# Altium project LM-003.PrjPcb (part 3 of 4)

## Sheet Connectors.SchDoc: Connectors
size OrCAD A; DocumentNumber: LM-003; Revision: 3.0; SheetNumber: 5; SheetTotal: 11
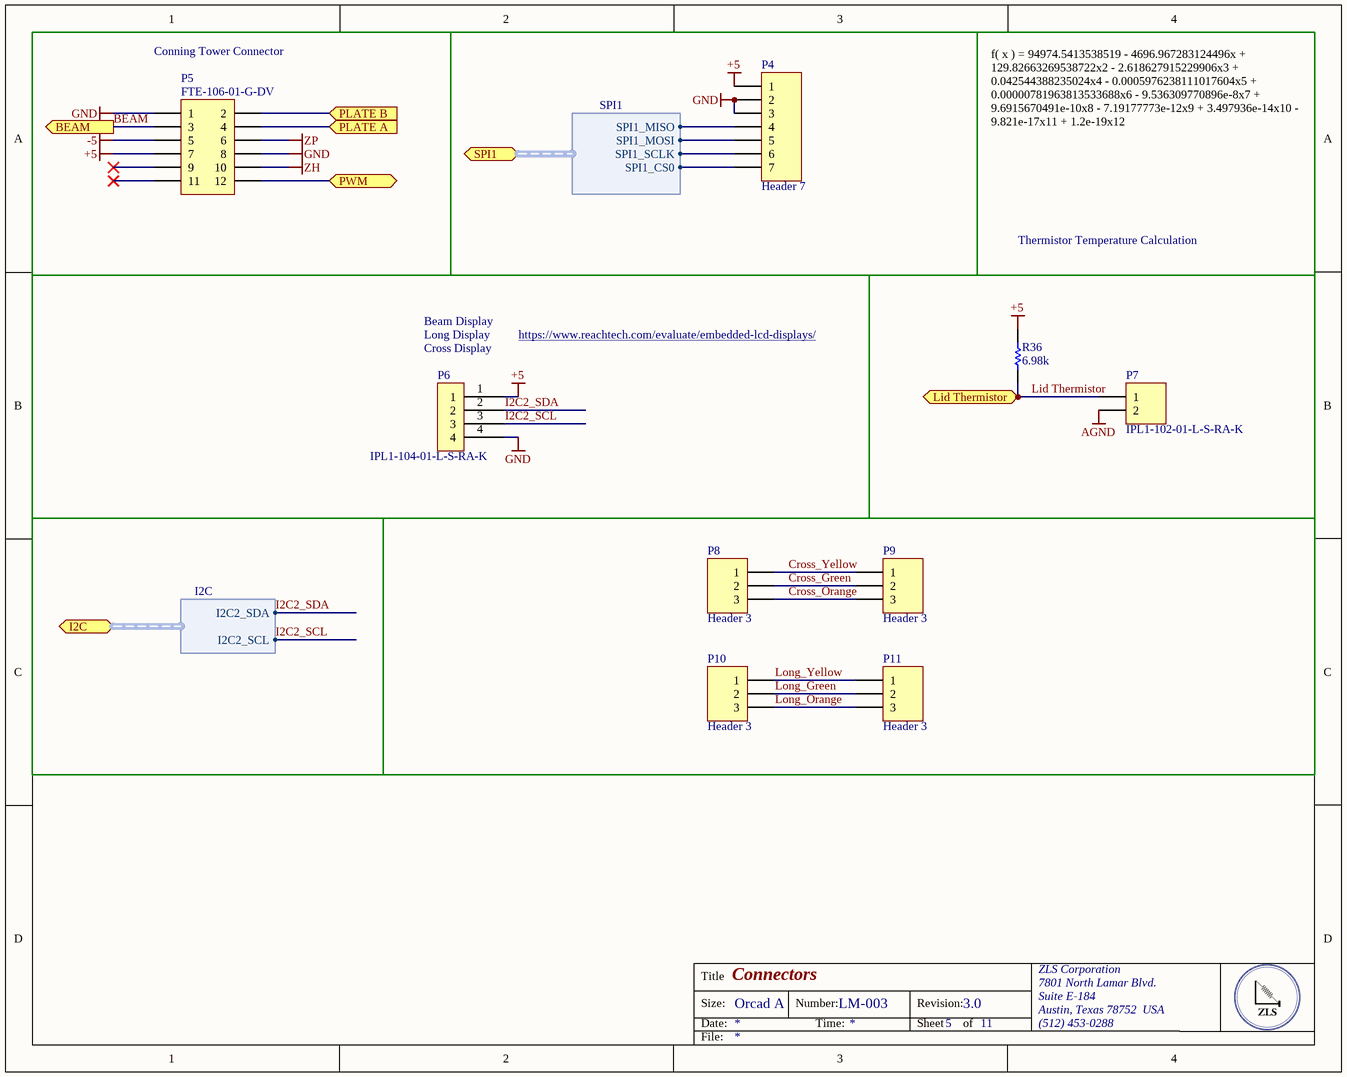
[diagram p4: Connectors.SchDoc]

### Parts
P4  Header 7  [HDR1X7]
P5  FTE-106-01-G-DV  [FTSH-106-01]
P6  IPL1-104-01-L-S-RA-K  [IPL1-104-01]
P7  IPL1-102-01-L-S-RA-K  [IPL1-102-01]
P8  Header 3  [HDR1X3]
P9  Header 3  [HDR1X3]
P10  Header 3  [HDR1X3]
P11  Header 3  [HDR1X3]
R36  Resistance (Ohms): 6.98k  [RESC0805(2012)_N]  (hidden comment: 6K98 1% 0805(2012))

### Blocks framed on the sheet
Conning Tower Connector: P5

### Ports
BEAM (out), I2C (harness I2C), Lid Thermistor, PLATE A (in), PLATE B (in), PWM, SPI1 (harness SPI1)

### Harnesses
I2C: I2C2_SDA, I2C2_SCL
SPI1: SPI1_CS0, SPI1_MISO, SPI1_MOSI, SPI1_SCLK

### Nets
+5: P4.1 P5.7 P6.1 R36.2
-5: P5.5
AGND: P7.2
GND: P4.2 P4.3 P5.1 P5.8 P6.4
ZH: P5.10
ZP: P5.6
BEAM: P5.3 ; port BEAM
Cross_Green: P8.2 P9.2
Cross_Orange: P8.3 P9.3
Cross_Yellow: P8.1 P9.1
I2C2_SCL: P6.3 ; port I2C.I2C2_SCL
I2C2_SDA: P6.2 ; port I2C.I2C2_SDA
Lid Thermistor: P7.1 R36.1 ; port Lid Thermistor
Long_Green: P10.2 P11.2
Long_Orange: P10.3 P11.3
Long_Yellow: P10.1 P11.1
SPI1_CS0: P4.7 ; port SPI1.SPI1_CS0
SPI1_MISO: P4.4 ; port SPI1.SPI1_MISO
SPI1_MOSI: P4.5 ; port SPI1.SPI1_MOSI
SPI1_SCLK: P4.6 ; port SPI1.SPI1_SCLK
NetP5_2: P5.2 ; port PLATE B
NetP5_4: P5.4 ; port PLATE A
NetP5_12: P5.12 ; port PWM

Not connected (* = marked no-connect by the designer): P5 9* 11*

### Notes on the sheet
- f( x ) = 94974.5413538519 - 4696.967283124496x + 129.82663269538722x2 - 2.618627915229906x3 + 0.042544388235024x4 - 0.0005976238111017604x5 + 0.00000781963813533688x6 - 9.536309770896e-8x7 + 9.6915670491e-10x8 - 7.19177773e-12x9 + 3.497936e-14x10 - 9.821e-17x11 + 1.2e-19x12
- Thermistor Temperature Calculation
- (near P6) Cross Display
- Long Display
- Beam Display
- https://www.reachtech.com/evaluate/embedded-lcd-displays/
- Title
- Size:
- Date:
- Orcad A
- Number:
- Time:
- Revision:
- Sheet
- of
- ZLS Corporation
- 7801 North Lamar Blvd.
- Suite E-184
- Austin, Texas 78752  USA
- (512) 453-0288
- File:

### Library data of the parts
P4 = Header 7: Header, 7-Pin; LatestRevisionDate: 17-Jul-2002; LatestRevisionNote: Re-released for DXP Platform.; Publisher: Altium Limited
P5 = Header 6X2: Header, 6-Pin, Dual row; Manufacturer: Samtec; Connector Type: Male Header; No. of positions: 6; No. of Rows: 2; Pitch: 0.8mm; Number of Positions: 12; Number of Positions Loaded: All; Row Spacing: 0.047" (1.20mm); Molding Height Above Board: 0.067" (1.70mm); Pitch Spacing: 0.8; Contact Termination: Surface Mount Vertical; LatestRevisionDate: 17-Jul-2002; LatestRevisionNote: Re-released for DXP Platform.; Publisher: Altium Limited; Supplier 1: Newark; ComponentLink1URL: http://www.samtec.com/; ComponentLink2URL: http://www.samtec.com/technical-specifications/Default.aspx?SeriesMaster=FTE; Mounting Technology: Surface Mount; Supplier 2: Digi-Key; Manufacturer Part Number: FTE-106-01-G-DV; RoHS: RoHS Compliant; Category: Connectors, Interconnects; Stock 2: 0; Pricing 2: 1=7.49, 10=6.49, 100=5.4911, 500=4.36794, 1000=3.55676, 5000=3.24476, 10000=3.11996 (USD); Packaging: Tube; Number of Rows: 2; Height Stacking (Mating): -; Contact Mating Length: 0.075" (1.90mm); Mounting Type: Surface Mount; Termination: Solder; Contact Finish: Gold; Contact Finish Thickness: 10µin (0.25µm); Features: -; Color: Black; ComponentLink3URL: http://www.samtec.com/documents/webfiles/pdf/FTE_SM.PDF; ComponentLink3Description: http://www.samtec.com/documents/webfiles/pdf/FTE_SM.PDF; Stock 1: 0; Pricing 1: 1=3.26, 10=2.85, 100=2.43, 500=2, 1000=1.72, 5000=1.55, 10000=1.48 (USD); Series: FTE; No. of Contacts: 12; Gender: Header; Contact Plating: Gold; Contact Material: Phosphor Bronze; ComponentLink4URL: http://www.samtec.com/ftppub/pdf/FTE_SM.PDF; ComponentLink4Description: http://www.samtec.com/ftppub/pdf/FTE_SM.PDF; Supplier Part Number 1: 11P4479; Supplier Part Number 2: SAM1144-06-ND
P6 = 53047-0410: .100 TERMINAL ASSY; Manufacturer 1: Samtec Inc.; Category 1: Connectors, Interconnects; Connector Type: Header; Pitch - Mating: 0.100" (2.54mm); Style: Board to Cable/Wire; Shrouding: Shrouded - 4 Wall; Number of Positions: 4; Number of Positions Loaded: All; Contact Length - Mating: 0.215" (5.46mm); Contact Length - Post: 0.085" (2.16mm); Material Flammability Rating: UL94 V-0; Voltage Rating: 675VAC, 954VDC; Supplier 1: Digi-Key; Supplier Part Number 1: SAM9597-ND; Manufacturer Part Number 1: IPL1-104-01-L-S-RA-K; RoHS 1: RoHS Compliant; Description 1: .100 TERMINAL ASSY; Stock 1: 100; Pricing 1: 1=2.53, 10=2.424, 25=2.222, 50=2.121, 100=2.02, 250=1.76752, 500=1.717, 1000=1.4645, 2500=1.3635 (USD); Packaging: Tube; Part Status: Active; Contact Type: Male Pin; Number of Rows: 1; Row Spacing - Mating: -; Mounting Type: Through Hole, Right Angle; Termination: Solder; Fastening Type: Locking Ramp; Overall Contact Length: -; Insulation Height: 0.240" (6.10mm); Contact Shape: Square; Contact Finish - Mating: Gold; Contact Finish Thickness - Mating: 10µin (0.25µm); Contact Finish - Post: Tin; Contact Material: Phosphor Bronze; Insulation Material: Liquid Crystal Polymer (LCP); Features: -; Operating Temperature: -55°C ~ 125°C; Ingress Protection: -; Insulation Color: Natural; Current Rating: -; Mated Stacking Heights: -; Contact Finish Thickness - Post: -; Applications: -; ComponentLink1URL: http://suddendocs.samtec.com/prints/ipl1-1xx-xx-xxx-s-xx-x-xx-mkt.pdf; ComponentLink1Description: http://suddendocs.samtec.com/prints/ipl1-1xx-xx-xxx-s-xx-x-xx-mkt.pdf
P7 = Header 2H: CONN SHROUDED PWR HEADER 2POS; Manufacturer 1: Samtec Inc.; Category 1: Connectors, Interconnects; Pitch - Mating: 0.100" (2.54mm); Style: Board to Cable/Wire; Shrouding: Shrouded - 4 Wall; Number of Positions: 2; Number of Positions Loaded: All; Contact Length - Mating: 0.215" (5.46mm); Contact Length - Post: 0.085" (2.16mm); Material Flammability Rating: UL94 V-0; Voltage Rating: 675VAC, 954VDC; Supplier 1: Digi-Key; Supplier Part Number 1: SAM10566-ND; Manufacturer Part Number 1: IPL1-102-01-L-S-RA-K; RoHS 1: RoHS Compliant; Description 1: CONN SHROUDED PWR HEADER 2POS; Stock 1: 0; Pricing 1: 1=2.44, 10=2.217, 25=2.0816, 50=1.991, 100=1.9005, 250=1.71952, 500=1.58376, 1000=1.3575, 2500=1.267 (USD); Packaging: Tube; Part Status: Active; Connector Type: Header; Contact Type: Male Pin; Number of Rows: 1; Row Spacing - Mating: -; Mounting Type: Through Hole, Right Angle; Termination: Solder; Fastening Type: Locking Ramp; Overall Contact Length: -; Insulation Height: 0.240" (6.10mm); Contact Shape: Square; Contact Finish - Mating: Gold; Contact Finish Thickness - Mating: 10µin (0.25µm); Contact Finish - Post: Tin; Contact Material: Phosphor Bronze; Insulation Material: Liquid Crystal Polymer (LCP); Features: -; Operating Temperature: -55°C ~ 125°C; Ingress Protection: -; Insulation Color: Natural; Current Rating: -; Mated Stacking Heights: -; Contact Finish Thickness - Post: -; Applications: -; ComponentLink1URL: http://suddendocs.samtec.com/prints/ipl1-1xx-xx-xxx-s-xx-x-xx-mkt.pdf; ComponentLink1Description: http://suddendocs.samtec.com/prints/ipl1-1xx-xx-xxx-s-xx-x-xx-mkt.pdf
P8-P11 = Header 3: Header, 3-Pin; LatestRevisionDate: 17-Jul-2002; LatestRevisionNote: Re-released for DXP Platform.; Publisher: Altium Limited
R36 = CMP-1013-00606-1: 6K98 0.125W 1% 0805 (2012 Metric)  SMD; Manufacturer: Vishay Dale; Manufacturer Part Number: CRCW08056K98FKEA; Power (Watts): 0.125W, 1/8W; Temperature Coefficient: ±100ppm/°C; Supplier 1: Digi-Key; Supplier Part Number 1: 541-6.98KCCT-ND; RoHS: RoHS Compliant; Category: Resistors; Stock 1: 34245; Pricing 1: 1=0.1, 10=0.044, 100=0.0178, 1000=0.00802, 2500=0.00696 (USD); Packaging: Cut Tape (CT); Part Status: Active; Tolerance: ±1%; Composition: Thick Film; Features: Automotive AEC-Q200; Operating Temperature: -55°C ~ 155°C; Package / Case: 0805 (2012 Metric); Supplier Device Package: 0805; Size / Dimension: 0.079" L x 0.049" W (2.00mm x 1.25mm); Height - Seated (Max): 0.020" (0.50mm); Failure Rate: -; ComponentLink1URL: http://www.vishay.com/docs/20035/dcrcwe3.pdf; ComponentLink1Description: http://www.vishay.com/docs/20035/dcrcwe3.pdf

## Sheet heater_control.SchDoc: Heater Control
size Tabloid; DocumentNumber: LM-003; Revision: 3.0; SheetNumber: 6; SheetTotal: 11
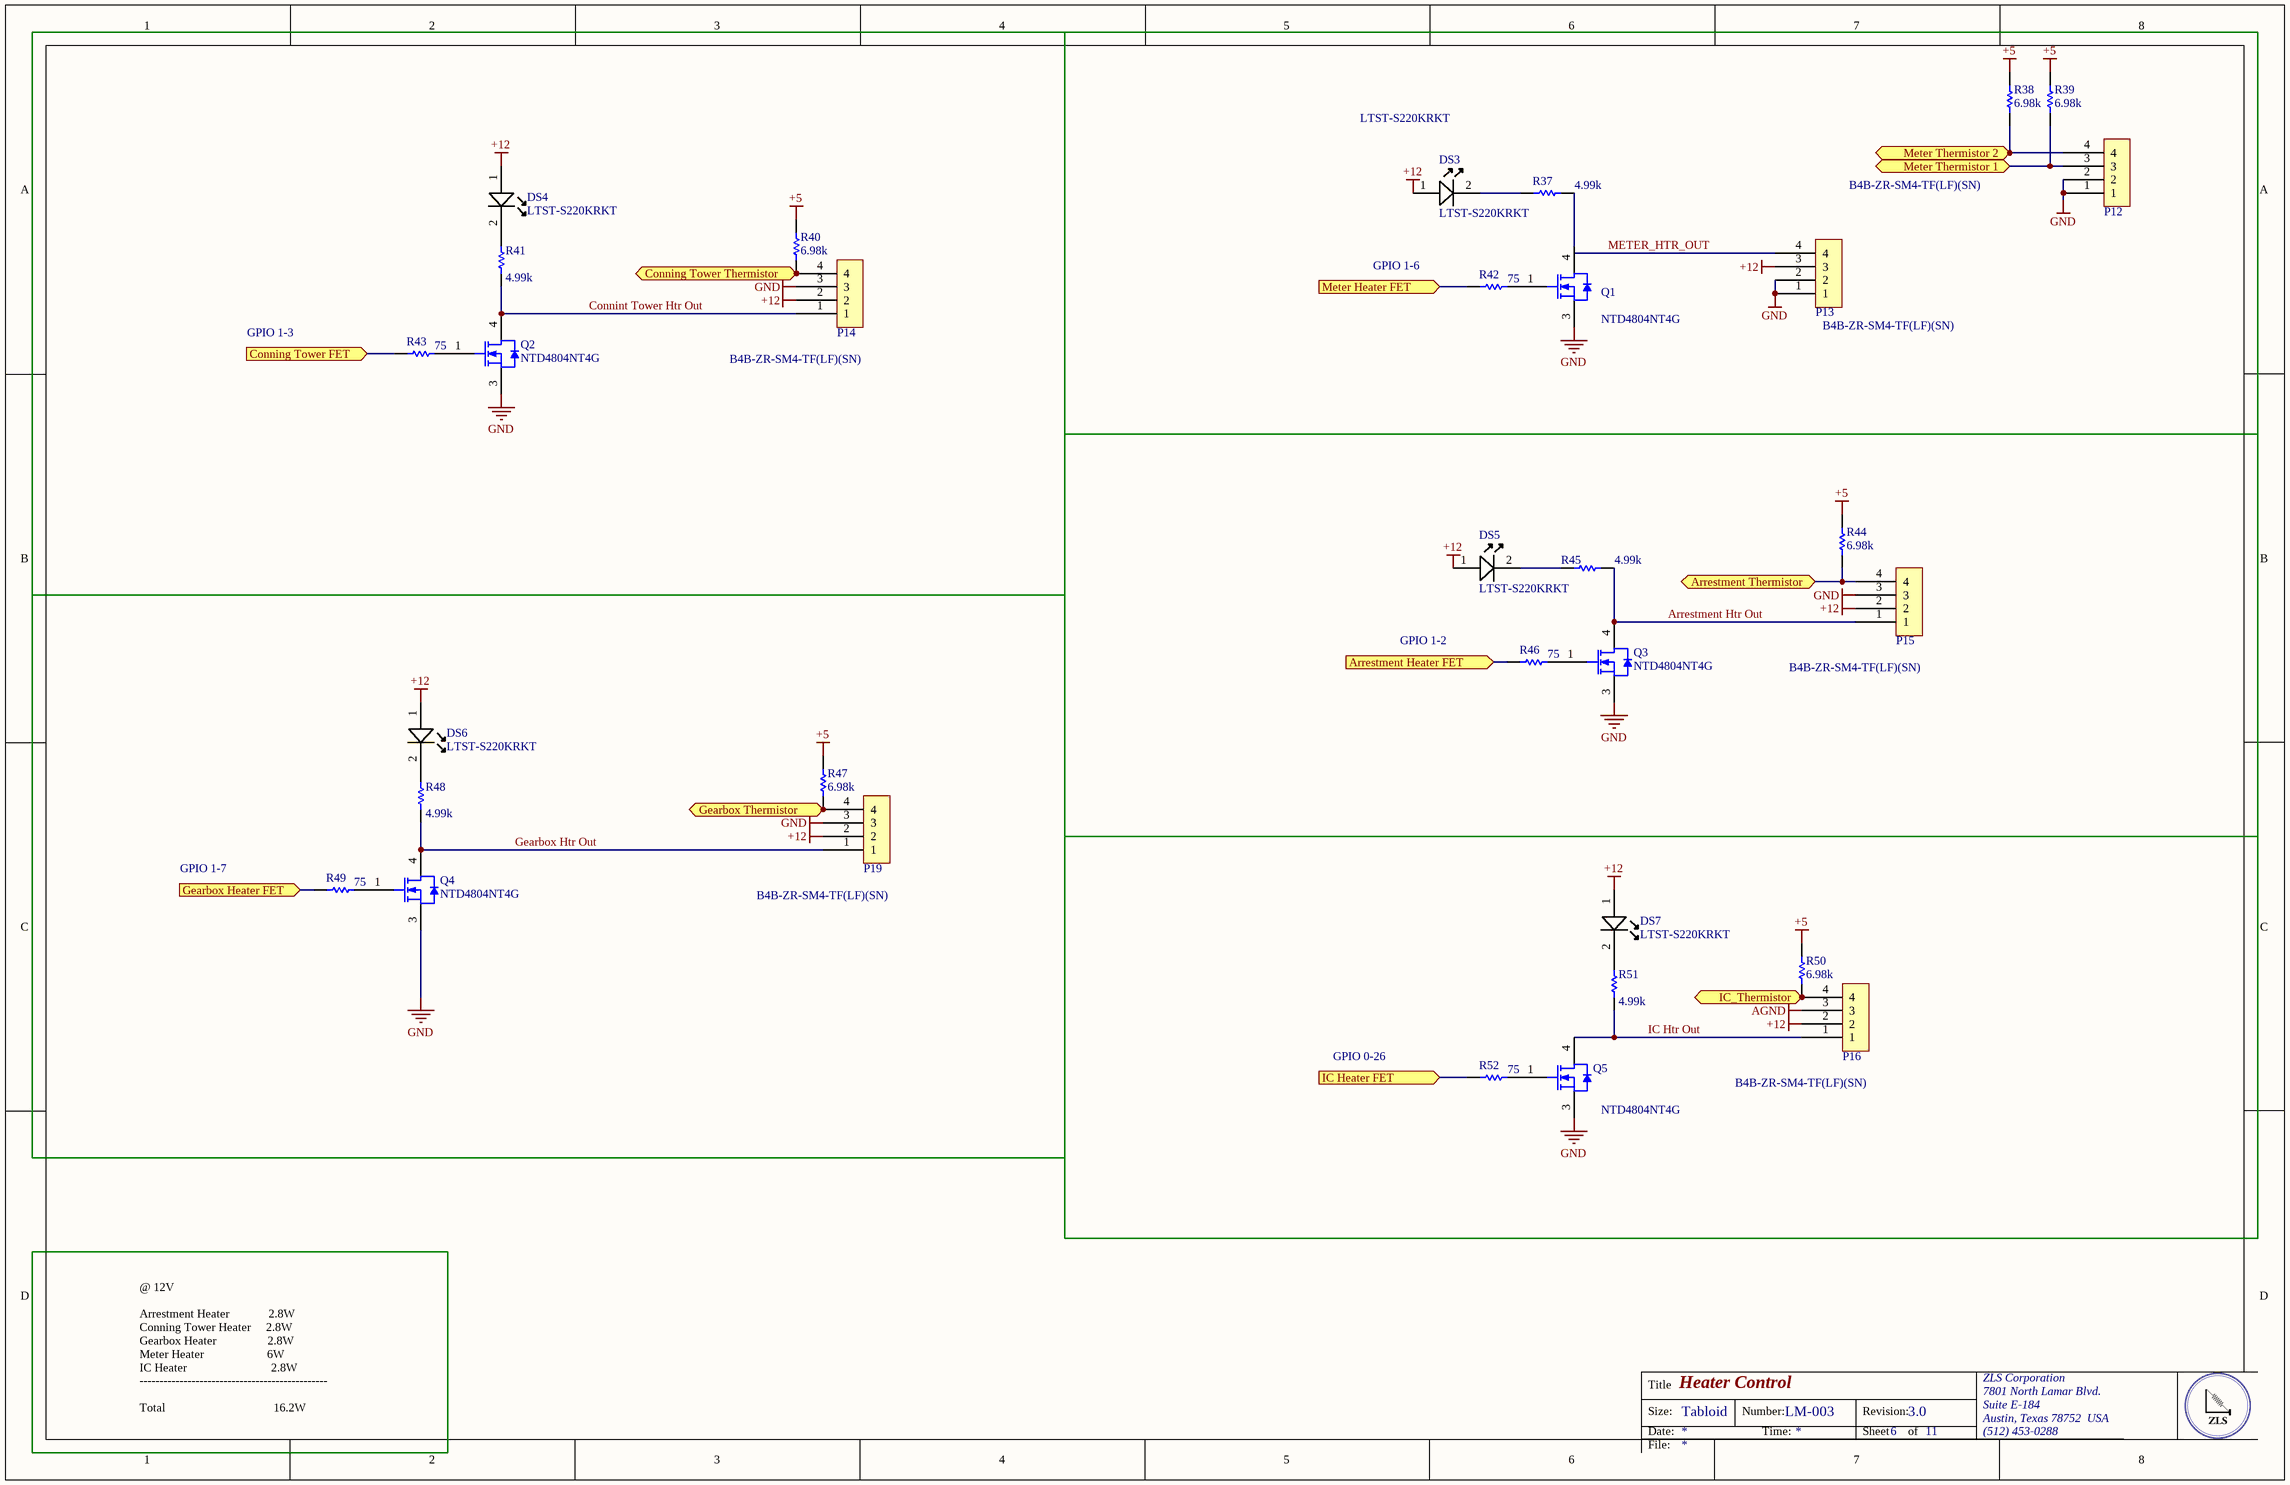
[diagram p5: heater_control.SchDoc]

### Parts
DS3  Manufacturer Part Number: LTST-S220KRKT  [0805C_L]  (hidden comment: Visible Name Value Type    False Description Lite-On LTST-S220KRKT Red LED, 631 nm 2012 (0805) Side View, Rectangle Lens SMD package STRING)
DS4  Manufacturer Part Number: LTST-S220KRKT  [0805C_L]  (hidden comment: Visible Name Value Type    False Description Lite-On LTST-S220KRKT Red LED, 631 nm 2012 (0805) Side View, Rectangle Lens SMD package STRING)
DS5  Manufacturer Part Number: LTST-S220KRKT  [0805C_L]  (hidden comment: Visible Name Value Type    False Description Lite-On LTST-S220KRKT Red LED, 631 nm 2012 (0805) Side View, Rectangle Lens SMD package STRING)
DS6  Manufacturer Part Number: LTST-S220KRKT  [0805C_L]  (hidden comment: Visible Name Value Type    False Description Lite-On LTST-S220KRKT Red LED, 631 nm 2012 (0805) Side View, Rectangle Lens SMD package STRING)
DS7  Manufacturer Part Number: LTST-S220KRKT  [0805C_L]  (hidden comment: Visible Name Value Type    False Description Lite-On LTST-S220KRKT Red LED, 631 nm 2012 (0805) Side View, Rectangle Lens SMD package STRING)
P12  Manufacturer Part Number: B4B-ZR-SM4-TF(LF)(SN)  [B4B-ZR-SM4-TF]  (hidden comment: CONN HEADER ZH TOP 4POS 1.5MM)
P13  Manufacturer Part Number: B4B-ZR-SM4-TF(LF)(SN)  [B4B-ZR-SM4-TF]  (hidden comment: CONN HEADER ZH TOP 4POS 1.5MM)
P14  Manufacturer Part Number: B4B-ZR-SM4-TF(LF)(SN)  [B4B-ZR-SM4-TF]  (hidden comment: CONN HEADER ZH TOP 4POS 1.5MM)
P15  Manufacturer Part Number: B4B-ZR-SM4-TF(LF)(SN)  [B4B-ZR-SM4-TF]  (hidden comment: CONN HEADER ZH TOP 4POS 1.5MM)
P16  Manufacturer Part Number: B4B-ZR-SM4-TF(LF)(SN)  [B4B-ZR-SM4-TF]  (hidden comment: CONN HEADER ZH TOP 4POS 1.5MM)
P19  Manufacturer Part Number: B4B-ZR-SM4-TF(LF)(SN)  [B4B-ZR-SM4-TF]  (hidden comment: CONN HEADER ZH TOP 4POS 1.5MM)
Q1  NTD4804NT4G  [ONSC-DPAK-3-369AA-01_V]
Q2  NTD4804NT4G  [ONSC-DPAK-3-369AA-01_V]
Q3  NTD4804NT4G  [ONSC-DPAK-3-369AA-01_V]
Q4  NTD4804NT4G  [ONSC-DPAK-3-369AA-01_V]
Q5  NTD4804NT4G  [ONSC-DPAK-3-369AA-01_V]
R37  Resistance (Ohms): 4.99k  [RESC0805(2012)_L]
R38  Resistance (Ohms): 6.98k  [RESC0805(2012)_N]  (hidden comment: 6K98 1% 0805(2012))
R39  Resistance (Ohms): 6.98k  [RESC0805(2012)_N]  (hidden comment: 6K98 1% 0805(2012))
R40  Resistance (Ohms): 6.98k  [RESC0805(2012)_N]  (hidden comment: 6K98 1% 0805(2012))
R41  Resistance (Ohms): 4.99k  [RESC0805(2012)_L]
R42  Resistance (Ohms): 75  [RESC0805(2012)_L]
R43  Resistance (Ohms): 75  [RESC0805(2012)_L]
R44  Resistance (Ohms): 6.98k  [RESC0805(2012)_N]  (hidden comment: 6K98 1% 0805(2012))
R45  Resistance (Ohms): 4.99k  [RESC0805(2012)_L]
R46  Resistance (Ohms): 75  [RESC0805(2012)_L]
R47  Resistance (Ohms): 6.98k  [RESC0805(2012)_N]  (hidden comment: 6K98 1% 0805(2012))
R48  Resistance (Ohms): 4.99k  [RESC0805(2012)_L]
R49  Resistance (Ohms): 75  [RESC0805(2012)_L]
R50  Resistance (Ohms): 6.98k  [RESC0805(2012)_N]  (hidden comment: 6K98 1% 0805(2012))
R51  Resistance (Ohms): 4.99k  [RESC0805(2012)_L]
R52  Resistance (Ohms): 75  [RESC0805(2012)_L]

### Blocks framed on the sheet
GPIO 1-3: DS4 P14 Q2 R40 R41 R43
GPIO 1-2: DS5 P15 Q3 R44-R46
GPIO 1-7: DS6 P19 Q4 R47-R49
GPIO 0-26: DS7 P16 Q5 R50-R52

### Ports
Arrestment Heater FET (in), Arrestment Thermistor, Conning Tower FET (in), Conning Tower Thermistor (out), Gearbox Heater FET (in), Gearbox Thermistor (out), IC Heater FET (in), IC_Thermistor, Meter Heater FET (in), Meter Thermistor 1, Meter Thermistor 2

### Nets
+5: R38.1 R39.2 R40.2 R44.1 R47.2 R50.1
+12: DS3.1(A) DS4.1(A) DS5.1(A) DS6.1(A) DS7.1(A) P13.3 P14.2 P15.2 P16.2 P19.2
AGND: P16.3
GND: P12.1 P12.2 P13.1 P13.2 P14.3 P15.3 P19.3 Q1.3(S) Q2.3(S) Q3.3(S) Q4.3(S) Q5.3(S)
Arrestment Htr Out: P15.1 Q3.4(D) R45.2
Connint Tower Htr Out: P14.1 Q2.4(D) R41.1
Gearbox Htr Out: P19.1 Q4.4(D) R48.1
IC Htr Out: P16.1 Q5.4(D) R51.2
METER_HTR_OUT: P13.4
NetDS3_2: DS3.2(K) R37.1
NetDS4_2: DS4.2(K) R41.2
NetDS5_2: DS5.2(K) R45.1
NetDS6_2: DS6.2(K) R48.2
NetDS7_2: DS7.2(K) R51.1
NetP12_3: P12.3 R39.1 ; port Meter Thermistor 1
NetP12_4: P12.4 R38.2 ; port Meter Thermistor 2
NetP14_4: P14.4 R40.1 ; port Conning Tower Thermistor
NetP15_4: P15.4 R44.2 ; port Arrestment Thermistor
NetP16_4: P16.4 R50.2 ; port IC_Thermistor
NetP19_4: P19.4 R47.1 ; port Gearbox Thermistor
NetQ1_1: Q1.1(G) R42.2
NetQ1_4: Q1.4(D) R37.2
NetQ2_1: Q2.1(G) R43.2
NetQ3_1: Q3.1(G) R46.2
NetQ4_1: Q4.1(G) R49.2
NetQ5_1: Q5.1(G) R52.2
NetR42_1: R42.1 ; port Meter Heater FET
NetR43_1: R43.1 ; port Conning Tower FET
NetR46_1: R46.1 ; port Arrestment Heater FET
NetR49_1: R49.1 ; port Gearbox Heater FET
NetR52_1: R52.1 ; port IC Heater FET

Not connected (* = marked no-connect by the designer): P12 5 6; P13 5 6; P14 5 6; P15 5 6; P16 5 6; P19 5 6

### Notes on the sheet
- LTST-S220KRKT
- GPIO 1-6
- @ 12V
  Arrestment Heater             2.8W
  Conning Tower Heater     2.8W
  Gearbox Heater                 2.8W
  Meter Heater                     6W
  IC Heater                            2.8W
  -----------------------------------------------
  Total                                    16.2W
- Title
- Size:
- Date:
- Tabloid
- Number:
- Time:
- Revision:
- Sheet
- of
- ZLS Corporation
- 7801 North Lamar Blvd.
- Suite E-184
- Austin, Texas 78752  USA
- (512) 453-0288
- File:

### Library data of the parts
DS3-DS7 = LED A/K: Manufacturer: Vishay / Lite-On; Lens Colour: Colorless; Lens Style: Diffused,Colorless; Viewing Angle: 130°; Luminous Intensity: 54mcd; Forward Current: 20mA; Forward Voltage: 2V; Power Rating: 75mW; Dominant Wavelength: 631nm; Lens Transparency: Clear; Number of Elements: 1; Wavelength: 639nm; Supplier 1: Digi-Key; Supplier Part Number 1: 160-1469-1-ND; Stock 1: 108191; Pricing 1: 1=0.31, 10=0.225, 25=0.1656, 100=0.1183, 250=0.0804, 500=0.071, 1000=0.0556 (USD); Mount: Surface Mount; Case/Package: 0805; Number of Pins: 2; Colour: Red; Case Code (Metric): 2012; Case Code (Imperial): 0805; Min Operating Temperature: -55°C; Max Operating Temperature: 85°C; Packaging: Tape and Reel; Package Quantity: 4000; Illumination Colour: Red; Test Current: 20mA; Power Dissipation: 75mW; Number of LEDs: 1; Length: 2.1mm; Height: 0.6mm; Width: 1mm; Depth: 0.6mm; Radiation Hardening: No; Lead Free: Lead Free; ComponentLink1URL: https://datasheet.ciiva.com/2110/s-110-ltst-s220krkt-2110132.pdf; ComponentLink1Description: https://datasheet.ciiva.com/2110/s-110-ltst-s220krkt-2110132.pdf; ComponentLink2URL: https://datasheet.ciiva.com/2110/s-110-ltst-s220krkt-2110133.pdf; ComponentLink2Description: https://datasheet.ciiva.com/2110/s-110-ltst-s220krkt-2110133.pdf; ComponentLink3URL: https://datasheet.ciiva.com/2110/s-110-ltst-s220krkt-2110134.pdf; ComponentLink3Description: https://datasheet.ciiva.com/2110/s-110-ltst-s220krkt-2110134.pdf; ComponentLink4URL: https://datasheet.ciiva.com/12403/lite-on-ltst-s220krkt-187389-12403798.pdf; ComponentLink4Description: https://datasheet.ciiva.com/12403/lite-on-ltst-s220krkt-187389-12403798.pdf; ComponentLink5URL: https://datasheet.ciiva.com/16345/lite-onltst-s220krkt-16345511.pdf; ComponentLink5Description: https://datasheet.ciiva.com/16345/lite-onltst-s220krkt-16345511.pdf; ComponentLink6URL: https://datasheet.ciiva.com/15118/getdatasheetpartid-225752-15118120.pdf; ComponentLink6Description: https://datasheet.ciiva.com/15118/getdatasheetpartid-225752-15118120.pdf; ComponentLink7URL: https://datasheet.ciiva.com/14633/0900766b80dc0b76-14633737.pdf; ComponentLink7Description: https://datasheet.ciiva.com/14633/0900766b80dc0b76-14633737.pdf; ComponentLink8URL: https://datasheet.ciiva.com/11775/0900766b80dc0b76-11775439.pdf; ComponentLink8Description: https://datasheet.ciiva.com/11775/0900766b80dc0b76-11775439.pdf
P12-P16 P19 = B4B-ZR-SM4-TF: Manufacturer: JST Sales America Inc.; Pitch - Mating: 0.059" (1.50mm); Style: Board to Cable/Wire; Shrouding: Shrouded - 4 Wall; Number of Positions: 4; Number of Positions Loaded: All; Material Flammability Rating: UL94 V-0; Current Rating: 1A; Voltage Rating: 50V; Mated Stacking Heights: 6.4mm; Supplier 1: Digi-Key; Supplier Part Number 1: 455-1683-1-ND; RoHS: RoHS Compliant; Category: Connectors, Interconnects; Stock 1: 38430; Pricing 1: 1=0.71, 10=0.67, 100=0.5138, 500=0.44682 (USD); Packaging: Cut Tape (CT); Part Status: Active; Connector Type: Header; Contact Type: Male Pin; Number of Rows: 1; Row Spacing - Mating: -; Mounting Type: Surface Mount; Termination: Solder; Fastening Type: Detent Lock; Contact Length - Mating: -; Contact Length - Post: -; Overall Contact Length: -; Insulation Height: 0.197" (5.00mm); Contact Shape: Circular; Contact Finish - Mating: Tin; Contact Finish Thickness - Mating: -; Contact Finish - Post: Tin; Contact Material: Brass; Insulation Material: Polyamide (PA6T), Nylon 6T, Glass Filled; Features: Solder Retention; Operating Temperature: -25°C ~ 85°C; Ingress Protection: -; Insulation Color: Natural; Contact Finish Thickness - Post: -; Applications: -; ComponentLink1URL: http://www.jst-mfg.com/product/pdf/eng/eZH.pdf; ComponentLink1Description: http://www.jst-mfg.com/product/pdf/eng/eZH.pdf
Q1-Q5 = CMP-1058-00341-1: Power MOSFET, 30 V, 117 A, Single N-Channel, 3-Pin DPAK, Pb-Free, Tape and Reel; Manufacturer: On Semiconductor; Coss Typ (pF): 952; Qrr Typ (nC): 30; VGS Max (V): 20; ID Max (A): 117; Crss Typ (pF): 556; Channel Polarity: N Channel; Ciss Typ (pF): 4490; VGS(th) Max (V): 2.5; ComponentLink2Description: Datasheet; ComponentLink3Description: Package Specification; Mounting Technology: Surface Mount; PackageDescription: 3-Pin Flange Mount, Body 6.54 x 6.095 mm, Pitch 2.29 mm; PackageVersion: Rev. B, 06/2010; PartNumber: NTD4804NT4G; ComponentLink2URL: http://www.onsemi.cn/pub_link/Collateral/NTD4804N-D.PDF; RoHS: Pb-Free; Configuration: Single; DatasheetVersion: Rev. 8; PackageReference: DPAK-3-369AA-01; ComponentLink3URL: http://www.onsemi.cn/pub_link/Collateral/369AA.PDF; ComponentLink1Description: Manufacturer URL; Packing: Tape and Reel; Package Type: DPAK-3; ComponentLink1URL: http://www.onsemi.com/; V(BR)DSS Min (V): 30; Supplier 1: Digi-Key; Supplier Part Number 1: NTD4804NT4GOSDKR-ND
R37 R41 R45 R48 R51 = CMP-1013-00393-1: Manufacturer: Vishay Dale; Manufacturer Part Number: CRCW08054K99FKEA; Tolerance: ±1%; Power (Watts): 0.125W, 1/8W; Temperature Coefficient: ±100ppm/°C; Supplier 1: Digi-Key; Supplier Part Number 1: 541-4.99KCCT-ND; RoHS: RoHS Compliant; Category: Resistors; Stock 1: 93740; Pricing 1: 1=0.1, 10=0.044, 100=0.0178, 1000=0.00802, 2500=0.00696 (USD); Packaging: Cut Tape (CT); Part Status: Active; Composition: Thick Film; Features: Automotive AEC-Q200; Operating Temperature: -55°C ~ 155°C; Package / Case: 0805 (2012 Metric); Supplier Device Package: 0805; Size / Dimension: 0.079" L x 0.049" W (2.00mm x 1.25mm); Height - Seated (Max): 0.020" (0.50mm); Failure Rate: -; ComponentLink1URL: http://www.vishay.com/docs/20035/dcrcwe3.pdf; ComponentLink1Description: http://www.vishay.com/docs/20035/dcrcwe3.pdf
R38-R40 R44 R47 R50 = CMP-1013-00606-1: as R36 on sheet Connectors; Supplier 1: Digi-Key; Supplier Part Number 1: 541-6.98KCCT-ND; RoHS: RoHS Compliant; Category: Resistors; Stock 1: 34245; Pricing 1: 1=0.1, 10=0.044, 100=0.0178, 1000=0.00802, 2500=0.00696 (USD); Packaging: Cut Tape (CT); Part Status: Active; Tolerance: ±1%; Composition: Thick Film; Features: Automotive AEC-Q200; Operating Temperature: -55°C ~ 155°C; Package / Case: 0805 (2012 Metric); Supplier Device Package: 0805; Size / Dimension: 0.079" L x 0.049" W (2.00mm x 1.25mm); Height - Seated (Max): 0.020" (0.50mm); Failure Rate: -; ComponentLink1URL: http://www.vishay.com/docs/20035/dcrcwe3.pdf; ComponentLink1Description: http://www.vishay.com/docs/20035/dcrcwe3.pdf
R42 R43 R46 R49 R52 = CMP-1013-00393-1: Manufacturer: Vishay Dale; Manufacturer Part Number: CRCW080575R0FKEA; Tolerance: ±1%; Power (Watts): 0.125W, 1/8W; Temperature Coefficient: ±100ppm/°C; Supplier 1: Digi-Key; Supplier Part Number 1: 541-75.0CCT-ND; RoHS: RoHS Compliant; Category: Resistors; Stock 1: 32546; Pricing 1: 1=0.1, 10=0.044, 100=0.0178, 1000=0.00802, 2500=0.00696 (USD); Packaging: Cut Tape (CT); Part Status: Active; Composition: Thick Film; Features: Automotive AEC-Q200; Operating Temperature: -55°C ~ 155°C; Package / Case: 0805 (2012 Metric); Supplier Device Package: 0805; Size / Dimension: 0.079" L x 0.049" W (2.00mm x 1.25mm); Height - Seated (Max): 0.020" (0.50mm); Failure Rate: -; ComponentLink1URL: http://www.vishay.com/docs/20035/dcrcwe3.pdf; ComponentLink1Description: http://www.vishay.com/docs/20035/dcrcwe3.pdf

## Sheet Power Monitor.SchDoc: Power Monitor
size OrCAD A; DocumentNumber: LM-003; Revision: 3.0; SheetNumber: 7; SheetTotal: 11
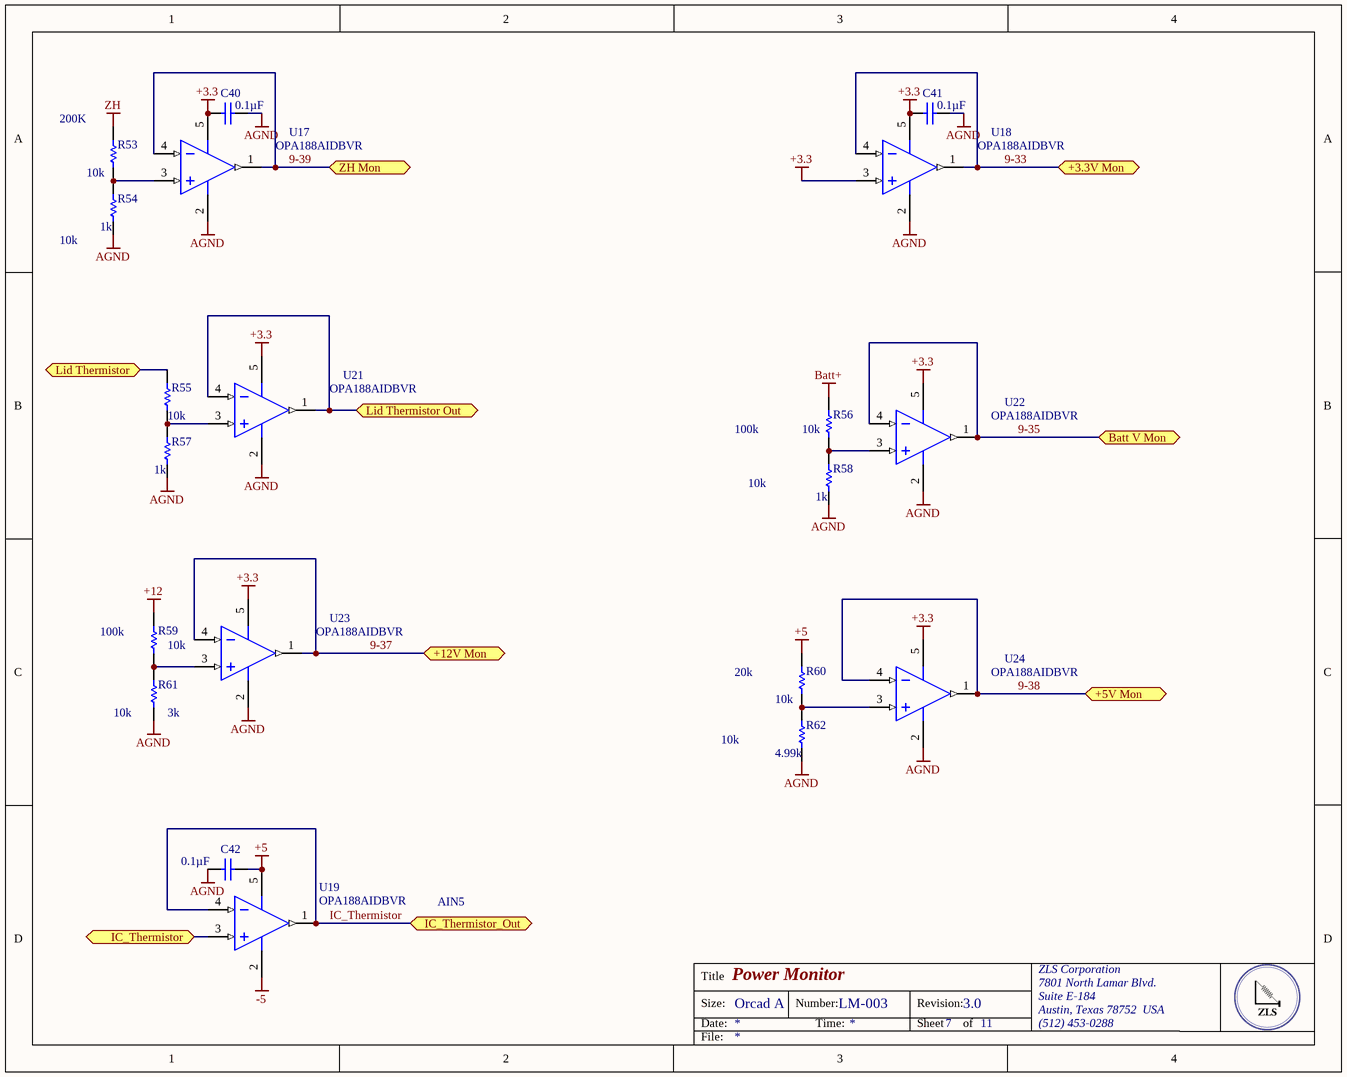
[diagram p6: Power Monitor.SchDoc]

### Parts
(Parts that share a designator on the sheet are numbered #1, #2 ... from top to bottom, then left to right.)
C40  Capacitance: 0.1µF  [CAPC0805(2012)145_N]  (hidden comment: CAP CER 0.1UF 25V X7R 0805)
C41  Capacitance: 0.1µF  [CAPC0805(2012)145_N]  (hidden comment: CAP CER 0.1UF 25V X7R 0805)
C42  Capacitance: 0.1µF  [CAPC0805(2012)145_N]  (hidden comment: CAP CER 0.1UF 16V X7R 0805)
R53  Resistance (Ohms): 10k  [RESC0805(2012)_L]  (hidden comment: RES SMD 10K OHM 1% 1/8W 0805)
R54  Resistance (Ohms): 1k  [RESC0805(2012)_L]  (hidden comment: RES SMD 1K OHM 1% 1/8W 0805)
R55  Resistance (Ohms): 10k  [RESC0805(2012)_L]  (hidden comment: RES SMD 10K OHM 1% 1/8W 0805)
R56  Resistance (Ohms): 10k  [RESC0805(2012)_L]  (hidden comment: RES SMD 10K OHM 1% 1/8W 0805)
R57  Resistance (Ohms): 1k  [RESC0805(2012)_L]  (hidden comment: RES SMD 1K OHM 1% 1/8W 0805)
R58  Resistance (Ohms): 1k  [RESC0805(2012)_L]  (hidden comment: RES SMD 1K OHM 1% 1/8W 0805)
R59  Resistance (Ohms): 10k  [RESC0805(2012)_L]  (hidden comment: RES SMD 10K OHM 1% 1/8W 0805)
R60  Resistance (Ohms): 10k  [RESC0805(2012)_L]  (hidden comment: RES SMD 10K OHM 1% 1/8W 0805)
R61  Resistance (Ohms): 3k  [RESC0805(2012)_L]  (hidden comment: RES SMD 3K OHM 1% 1/2W 0805)
R62  Resistance (Ohms): 4.99k  [RESC0805(2012)_L]  (hidden comment: RES SMD 4.99K OHM 1% 1/8W 0805)
U17  OPA188AIDBVR  [DBV0005A_M]
U18  OPA188AIDBVR  [DBV0005A_M]
U19  OPA188AIDBVR  [DBV0005A_M]
U21  OPA188AIDBVR  [DBV0005A_M]
U22  OPA188AIDBVR  [DBV0005A_M]
U23#2  OPA188AIDBVR  [DBV0005A_M]
U24  OPA188AIDBVR  [DBV0005A_M]

### Ports
+3.3V Mon, +5V Mon, +12V Mon, Batt V Mon, IC_Thermistor, IC_Thermistor_Out, Lid Thermistor, Lid Thermistor Out, ZH Mon

### Nets
+3.3: C40.1 C41.1 U17.5(V+) U18.3(IN+) U18.5(V+) U21.5(V+) U22.5(V+) U23#2.5(V+) U24.5(V+)
+5: C42.2 R60.2 U19.5(V+)
+12: R59.2
-5: U19.2(V-)
AGND: C40.2 C41.2 C42.1 R54.1 R57.1 R58.1 R61.1 R62.1 U17.2(V-) U18.2(V-) U21.2(V-) U22.2(V-) U23#2.2(V-) U24.2(V-)
Batt+: R56.2
ZH: R53.2
9-33: U18.1(OUT) U18.4(IN-) ; port +3.3V Mon
9-35: U22.1(OUT) U22.4(IN-) ; port Batt V Mon
9-37: U23#2.1(OUT) U23#2.4(IN-) ; port +12V Mon
9-38: U24.1(OUT) U24.4(IN-) ; port +5V Mon
9-39: U17.1(OUT) U17.4(IN-) ; port ZH Mon
IC_Thermistor: U19.1(OUT) U19.4(IN-) ; port IC_Thermistor_Out
Lid Thermistor: R55.2 ; port Lid Thermistor
NetP16_4: U19.3(IN+) ; port IC_Thermistor
NetR53_1: R53.1 R54.2 U17.3(IN+)
NetR55_1: R55.1 R57.2 U21.3(IN+)
NetR56_1: R56.1 R58.2 U22.3(IN+)
NetR59_1: R59.1 R61.2 U23#2.3(IN+)
NetR60_1: R60.1 R62.2 U24.3(IN+)
NetU21_1: U21.1(OUT) U21.4(IN-) ; port Lid Thermistor Out

### Notes on the sheet
- (near R53) 200K
- (near R54) 10k
- 100k
- 10k
- (near R59) 100k
- 20k
- (near R61) 10k
- AIN5
- Title
- Size:
- Date:
- Orcad A
- Number:
- Time:
- Revision:
- Sheet
- of
- ZLS Corporation
- 7801 North Lamar Blvd.
- Suite E-184
- Austin, Texas 78752  USA
- (512) 453-0288
- File:

### Library data of the parts
C40 C41 = CMP-1036-04795-1: Manufacturer: Murata Electronics North America; Manufacturer Part Number: GRM21BR71E104KA01L; Tolerance: ±10%; Supplier 1: Digi-Key; Supplier Part Number 1: 490-1673-6-ND; RoHS: RoHS Compliant; Category: Capacitors; Stock 1: 891652; Pricing 1: 1=0.2, 10=0.145, 100=0.0683, 500=0.04788, 1000=0.03964 (USD); Packaging: Digi-Reel®; Part Status: Active; Voltage - Rated: 25V; Temperature Coefficient: X7R; Operating Temperature: -55°C ~ 125°C; Features: -; Ratings: -; Applications: General Purpose; Mounting Type: Surface Mount, MLCC; Package / Case: 0805 (2012 Metric); Size / Dimension: 0.079" L x 0.049" W (2.00mm x 1.25mm); Height - Seated (Max): -; Thickness (Max): 0.053" (1.35mm); Lead Spacing: -; Lead Style: -; ComponentLink1URL: http://www.murata.com/~/media/webrenewal/support/library/catalog/products/capacitor/mlcc/c02e.ashx; ComponentLink1Description: http://www.murata.com/~/media/webrenewal/support/library/catalog/products/capacitor/mlcc/c02e.ashx
C42 = CMP-1036-04795-1: Manufacturer: Murata Electronics North America; Manufacturer Part Number: GRM219R71C104KA01D; Tolerance: ±10%; Voltage - Rated: 25V; Supplier Part Number 1: 490-1673-6-ND; Temperature Coefficient: X7R; Thickness (Max): 0.053" (1.35mm); Supplier 2: Digi-Key; Supplier Part Number 2: 490-1683-6-ND; RoHS: RoHS Compliant; Category: Capacitors; Stock 2: 245331; Pricing 2: 1=0.14, 10=0.098, 100=0.0462, 500=0.0324, 1000=0.02683 (USD); Packaging: Digi-Reel®; Part Status: Active; Operating Temperature: -55°C ~ 125°C; Features: -; Ratings: -; Applications: General Purpose; Mounting Type: Surface Mount, MLCC; Package / Case: 0805 (2012 Metric); Size / Dimension: 0.079" L x 0.049" W (2.00mm x 1.25mm); Height - Seated (Max): -; Lead Spacing: -; Lead Style: -; ComponentLink1URL: http://www.murata.com/~/media/webrenewal/support/library/catalog/products/capacitor/mlcc/c02e.ashx; ComponentLink1Description: http://www.murata.com/~/media/webrenewal/support/library/catalog/products/capacitor/mlcc/c02e.ashx
R53 R55 R56 R59 R60 = CMP-1013-00393-1: Manufacturer: Vishay Dale; Manufacturer Part Number: CRCW080510K0FKTA; Power (Watts): 0.125W, 1/8W; Temperature Coefficient: ±100ppm/°C; Supplier 1: Digi-Key; Supplier Part Number 1: 541-3016-6-ND; RoHS: RoHS non-compliant; Category: Resistors; Stock 1: 4898; Pricing 1: 1=0.14, 10=0.129, 100=0.0496, 1000=0.02183, 2500=0.01885 (USD); Packaging: Digi-Reel®; Part Status: Active; Tolerance: ±1%; Composition: Thick Film; Features: Automotive AEC-Q200; Operating Temperature: -55°C ~ 155°C; Package / Case: 0805 (2012 Metric); Supplier Device Package: 0805; Size / Dimension: 0.079" L x 0.049" W (2.00mm x 1.25mm); Height - Seated (Max): 0.020" (0.50mm); Failure Rate: -; ComponentLink1URL: http://www.vishay.com/docs/20008/dcrcw.pdf; ComponentLink1Description: http://www.vishay.com/docs/20008/dcrcw.pdf
R54 R57 R58 = CMP-1013-00393-1: Manufacturer: Vishay Dale; Manufacturer Part Number: CRCW08051K00FKEA; Power (Watts): 0.125W, 1/8W; Temperature Coefficient: ±100ppm/°C; Supplier 1: Digi-Key; Supplier Part Number 1: 541-1.00KCDKR-ND; RoHS: RoHS Compliant; Category: Resistors; Stock 1: 34392; Pricing 1: 1=0.1, 10=0.044, 100=0.0178, 1000=0.00802, 2500=0.00696 (USD); Packaging: Digi-Reel®; Part Status: Active; Tolerance: ±1%; Composition: Thick Film; Features: Automotive AEC-Q200; Operating Temperature: -55°C ~ 155°C; Package / Case: 0805 (2012 Metric); Supplier Device Package: 0805; Size / Dimension: 0.079" L x 0.049" W (2.00mm x 1.25mm); Height - Seated (Max): 0.020" (0.50mm); Failure Rate: -; ComponentLink1URL: http://www.vishay.com/docs/20035/dcrcwe3.pdf; ComponentLink1Description: http://www.vishay.com/docs/20035/dcrcwe3.pdf
R61 = CMP-1013-00393-1: Manufacturer: Vishay Dale; Manufacturer Part Number: CRCW08053K00FKEAHP; Power (Watts): 0.5W, 1/2W; Temperature Coefficient: ±100ppm/°C; Supplier 1: Digi-Key; Supplier Part Number 1: 541-3.00KTDKR-ND; RoHS: RoHS Compliant; Category: Resistors; Stock 1: 4756; Pricing 1: 1=0.28, 10=0.233, 100=0.0911, 1000=0.03812, 2500=0.03494 (USD); Packaging: Digi-Reel®; Part Status: Active; Tolerance: ±1%; Composition: Thick Film; Features: Automotive AEC-Q200, Pulse Withstanding; Operating Temperature: -55°C ~ 155°C; Package / Case: 0805 (2012 Metric); Supplier Device Package: 0805; Size / Dimension: 0.079" L x 0.049" W (2.00mm x 1.25mm); Height - Seated (Max): 0.020" (0.50mm); Failure Rate: -; ComponentLink1URL: http://www.vishay.com/docs/20043/crcwhpe3.pdf; ComponentLink1Description: http://www.vishay.com/docs/20043/crcwhpe3.pdf
R62 = CMP-1013-00393-1: Manufacturer: Vishay Dale; Manufacturer Part Number: CRCW08054K99FKTA; Power (Watts): 0.125W, 1/8W; Temperature Coefficient: ±100ppm/°C; Supplier 1: Digi-Key; Supplier Part Number 1: 541-3030-6-ND; RoHS: RoHS non-compliant; Category: Resistors; Stock 1: 14290; Pricing 1: 1=0.14, 10=0.129, 100=0.0496, 1000=0.02183, 2500=0.01885 (USD); Packaging: Digi-Reel®; Part Status: Active; Tolerance: ±1%; Composition: Thick Film; Features: Automotive AEC-Q200; Operating Temperature: -55°C ~ 155°C; Package / Case: 0805 (2012 Metric); Supplier Device Package: 0805; Size / Dimension: 0.079" L x 0.049" W (2.00mm x 1.25mm); Height - Seated (Max): 0.020" (0.50mm); Failure Rate: -; ComponentLink1URL: http://www.vishay.com/docs/20008/dcrcw.pdf; ComponentLink1Description: http://www.vishay.com/docs/20008/dcrcw.pdf
U17-U19 U21 U22 U23#2 U24 = CMP-0809-00005-2: Precision, Low Noise, Rail-to-Rail Output, Zero-Drift Operational Amplifier, 4 to 36 V, -40 to 125 degC, 5-pin SOT23 (DBV5), Green (RoHS & no Sb/Br); Manufacturer: Texas Instruments; Total Supply Voltage(Min)(+5V is 5, +/-5V is 10): 4; Offset Drift(Typ)(uV/C): 0.03; Rating: Catalog; SubFamily: Zero Drift Precision Amplifier; GBW(Typ)(MHz): 2; Slew Rate(Typ)(V/us): 0.8; Number of Channels: 1; CMRR(Min)(dB): 120; Iq per channel(Max)(mA): 0.51; Total Supply Voltage(Max)(+5V is 5, +/-5V is 10): 36; PartNumber: OPA188AIDBVR; ComponentLink2Description: Datasheet; ComponentLink2URL: http://www.ti.com/lit/ds/symlink/opa188.pdf; ComponentLink1Description: Manufacturer URL; Mounting Technology: Surface Mount; Eco-Plan: Green (RoHS & no Sb/Br); ComponentLink1URL: http://www.ti.com/; PackageVersion: 4073253-4/K, 03/2006; DatasheetVersion: SBOS642A; ComponentLink3Description: Package Specification; PackageReference: DBV0005A; ComponentLink3URL: http://www.ti.com/litv/pdf/mpds018i; PackageDescription: 5-Pin Plastic Small Outline, Body 1.6 x 2.9 mm, Pitch 0.95 mm; Code_JEDEC: MO-178

## Sheet Real Time Clock.SchDoc: Real Time Clock
size OrCAD A; DocumentNumber: LM-003; Revision: 3.0; SheetNumber: 8; SheetTotal: 11
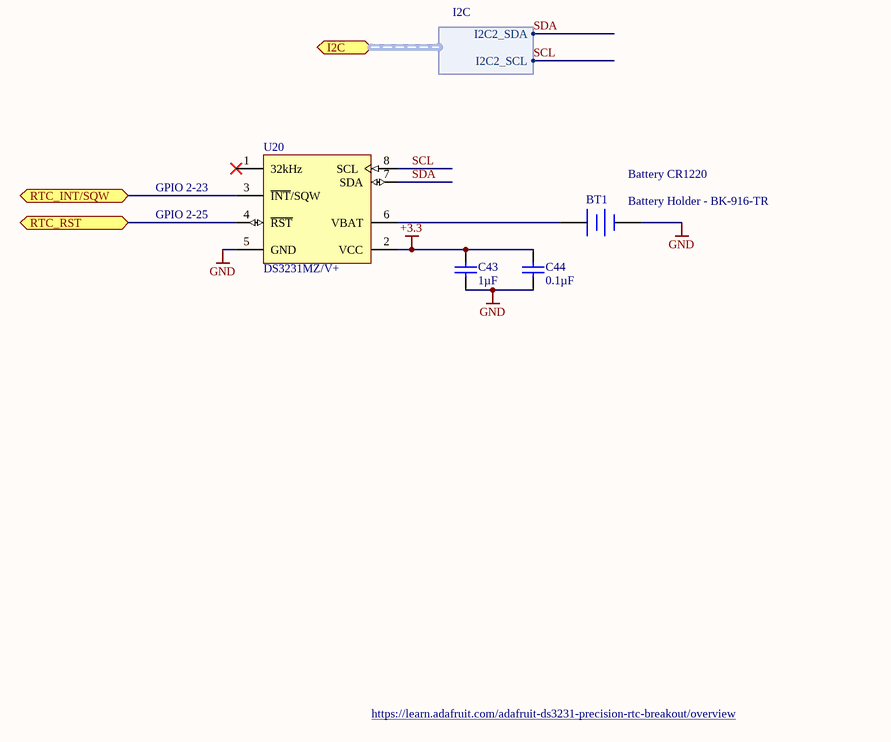
[diagram p7: Real Time Clock.SchDoc]

### Parts
BT1  Battery Holder - BK-916-TR  [BK-916-TR]
C43  Capacitance: 1µF  [CAPC0805(2012)100_M]  (hidden comment: CAP 1uF 25V 0805(2012))
C44  Capacitance: 0.1µF  [CAPC0805(2012)100_N]  (hidden comment: CAP 100nF 25V 0805(2012))
U20  DS3231MZ/V+  [S8MK+1_N]

### Ports
I2C (harness I2C), RTC_INT/SQW, RTC_RST (bidir)

### Harnesses
I2C: I2C2_SDA, I2C2_SCL

### Nets
+3.3: C43.1 C44.1 U20.2(VCC)
GND: BT1.2(-) C43.2 C44.2 U20.5(GND)
SCL: U20.8(SCL) ; port I2C.I2C2_SCL  [project net I2C2_SCL]
SDA: U20.7(SDA) ; port I2C.I2C2_SDA  [project net I2C2_SDA]
NetBT1_1: BT1.1(+) U20.6(VBAT)
NetU20_3: U20.3(~{INT}/SQW) ; port RTC_INT/SQW
NetU20_4: U20.4(~{RST}) ; port RTC_RST

Not connected (* = marked no-connect by the designer): U20 1(32kHz)*

### Notes on the sheet
- (near U20) GPIO 2-23
- (near BT1) Battery CR1220
- (near U20) GPIO 2-25
- https://learn.adafruit.com/adafruit-ds3231-precision-rtc-breakout/overview
- Title
- Size:
- Date:
- Orcad A
- Number:
- Time:
- Revision:
- Sheet
- of
- ZLS Corporation
- 7801 North Lamar Blvd.
- Suite E-184
- Austin, Texas 78752  USA
- (512) 453-0288
- File:

### Library data of the parts
BT1 = Battery: CR1220, 1225 BATTERY RETAINER W/; Manufacturer 1: MPD (Memory Protection Devices); Category 1: Battery Products; Battery Type, Function: Coin Cell, Retainer; Battery Cell Size: Coin, 12.0mm; Number of Cells: 1; Battery Series: 1216, 1220, 1225; Supplier 1: Digi-Key; Supplier Part Number 1: BK-916-CT-ND; Manufacturer Part Number 1: BK-916-TR; RoHS 1: RoHS Compliant; Description 1: CR1220, 1225 BATTERY RETAINER W/; Stock 1: 7084; Pricing 1: 1=0.49, 10=0.449, 100=0.408, 500=0.357 (USD); Part Status: Active; Style: Retainer; Mounting Type: PCB, Surface Mount; Termination Style: SMD (SMT) Tab; Height Above Board: 0.551" (14.00mm); Operating Temperature: -; ComponentLink1URL: http://www.memoryprotectiondevices.com/datasheets/BK-916-datasheet.pdf; ComponentLink1Description: http://www.memoryprotectiondevices.com/datasheets/BK-916-datasheet.pdf
C43 = CMP-1036-04754-1: CAP 1uF 25V ±10% 0805 (2012 Metric) Thickness 1mm SMD; Manufacturer: Murata Electronics North America; Manufacturer Part Number: GRM21BR71E105KA99L; Temperature Coefficient: X7R; Supplier 1: Digi-Key; Supplier Part Number 1: 490-6484-1-ND; RoHS: RoHS Compliant; Category: Capacitors; Stock 1: 295334; Pricing 1: 1=0.14, 10=0.099, 100=0.0468, 1000=0.02715 (USD); Packaging: Cut Tape (CT); Part Status: Active; Tolerance: ±10%; Voltage - Rated: 25V; Operating Temperature: -55°C ~ 125°C; Features: -; Ratings: -; Applications: General Purpose; Mounting Type: Surface Mount, MLCC; Package / Case: 0805 (2012 Metric); Size / Dimension: 0.079" L x 0.049" W (2.00mm x 1.25mm); Height - Seated (Max): -; Thickness (Max): 0.053" (1.35mm); Lead Spacing: -; Lead Style: -; ComponentLink1URL: http://www.murata.com/~/media/webrenewal/support/library/catalog/products/capacitor/mlcc/c02e.ashx; ComponentLink1Description: http://www.murata.com/~/media/webrenewal/support/library/catalog/products/capacitor/mlcc/c02e.ashx
C44 = CMP-1036-04416-1: CAP 100nF 25V -20% to +80% 0805 (2012 Metric) Thickness 1mm SMD; Manufacturer: Murata Electronics North America; Manufacturer Part Number: GRM21BR71E104KA01L; Tolerance: ±10%; Temperature Coefficient: X7R; Supplier 1: Digi-Key; Supplier Part Number 1: 490-1673-1-ND; RoHS: RoHS Compliant; Category: Capacitors; Stock 1: 895391; Pricing 1: 1=0.2, 10=0.145, 100=0.0683, 500=0.04788, 1000=0.03964 (USD); Packaging: Cut Tape (CT); Part Status: Active; Voltage - Rated: 25V; Operating Temperature: -55°C ~ 125°C; Features: -; Ratings: -; Applications: General Purpose; Mounting Type: Surface Mount, MLCC; Package / Case: 0805 (2012 Metric); Size / Dimension: 0.079" L x 0.049" W (2.00mm x 1.25mm); Height - Seated (Max): -; Thickness (Max): 0.053" (1.35mm); Lead Spacing: -; Lead Style: -; ComponentLink1URL: http://www.murata.com/~/media/webrenewal/support/library/catalog/products/capacitor/mlcc/c02e.ashx; ComponentLink1Description: http://www.murata.com/~/media/webrenewal/support/library/catalog/products/capacitor/mlcc/c02e.ashx
U20 = CMP-0254-00374-1: +/-5ppm, I2C Real-Time Clock with Internal MEMs Resonator, 8-Pin SO, -40 to 85 degC, Automotive Qualified, Pb-Free; PackageDescription: 8-Pin Small-Outline IC, Narrow (0.15in), 1.27 mm Pitch, SOIC (N), Pb-Free; PackageVersion: revC, 2010; PackageReference: S8MK+1; ComponentLink1URL: http://www.maxim-ic.com; ComponentLink3Description: Package Specification; DatasheetVersion: Rev 3, Dec-2011; ComponentLink3URL: http://pdfserv.maxim-ic.com/package_dwgs/21-0041.PDF; ComponentLink1Description: Manufacturer URL; Code_JEDEC: MS-012-AA; ComponentLink2Description: Datasheet; Code_IPC: SOIC127P600-8; ComponentLink2URL: http://datasheets.maxim-ic.com/en/ds/DS3231M.pdf

## Sheet RS232.SchDoc: RS232
size OrCAD A; DocumentNumber: LM-003; Revision: 3.0; SheetNumber: 9; SheetTotal: 11
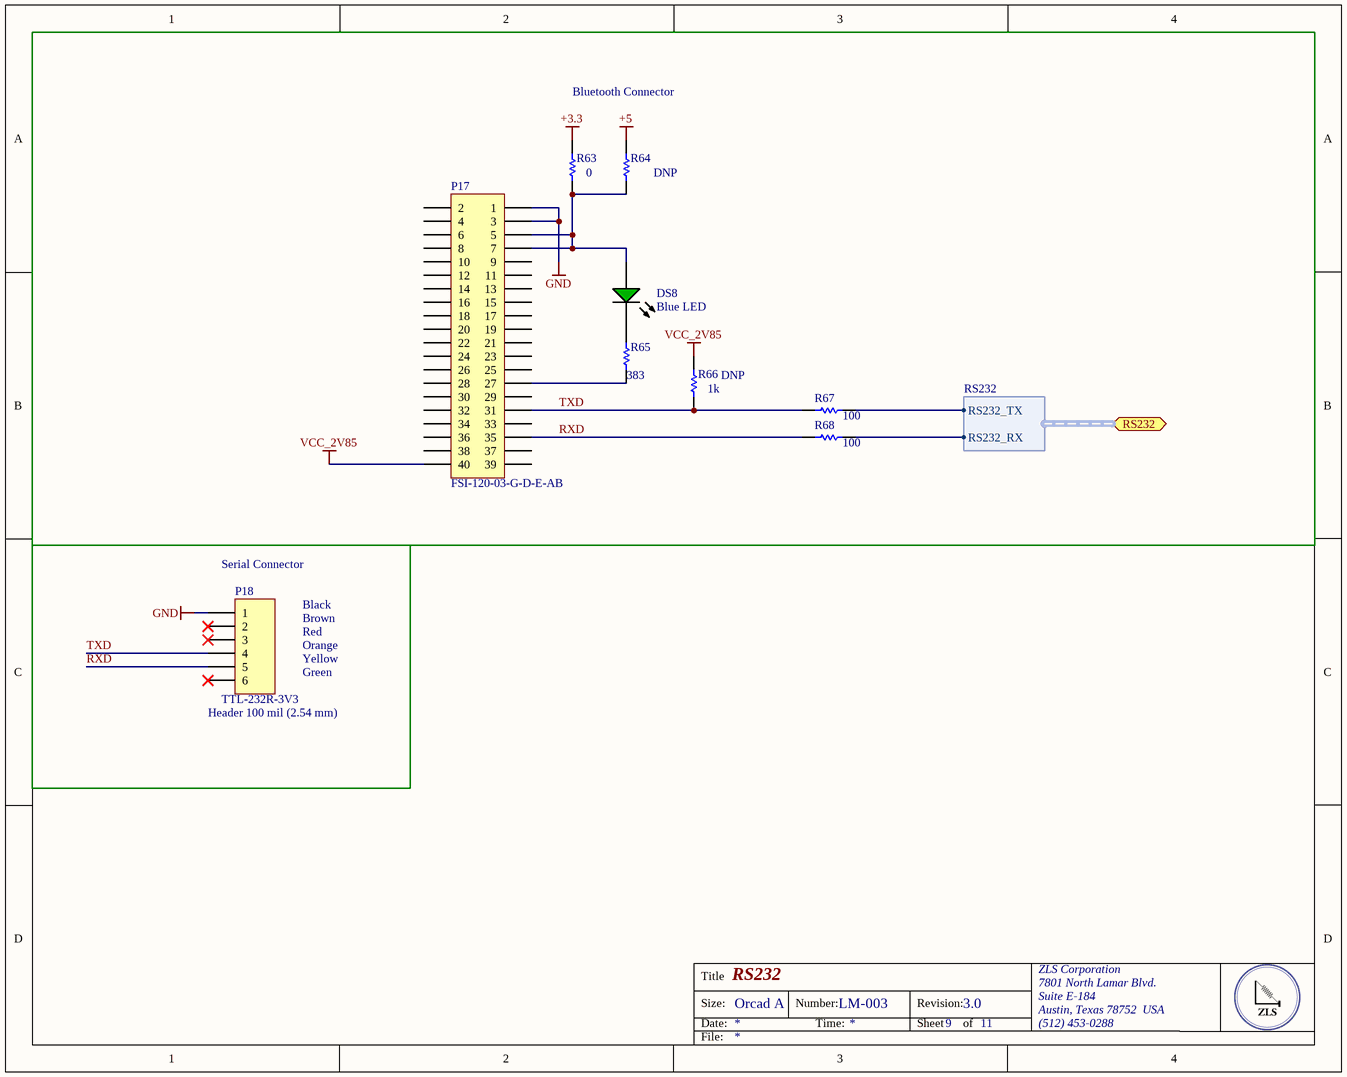
[diagram p8: RS232.SchDoc]

### Parts
DS8  Blue LED  [KING-LED0603-25-GREEN_V]
P17  FSI-120-03-G-D-E-AB  [FSI-120-03-G-D-E-AB]
P18  Header 100 mil (2.54 mm)  [HDR1X6]
R63  Resistance: 0  [RESC0805(2012)_M]  (hidden comment: RES SMD 0.0 OHM JUMPER 1/8W 0805)
R64  DNP  [RESC0805(2012)_M]
R65  Resistance (Ohms): 383  [RESC0805(2012)_M]  (hidden comment: RES SMD 383 OHM 1% 1/8W 0805)
R66  DNP  Resistance (Ohms): 1k  [RESC0805(2012)_M]
R67  Resistance (Ohms): 100  [RESC0805(2012)_L]  (hidden comment: RES SMD 100 OHM 1% 1/8W 0805)
R68  Resistance (Ohms): 100  [RESC0805(2012)_N]  (hidden comment: RES SMD 100 OHM 1% 1/8W 0805)

### Blocks framed on the sheet
Bluetooth Connector: DS8 P17 R63-R68

### Ports
RS232 (harness RS232)

### Harnesses
RS232: RS232_RX, RS232_TX

### Nets
+3.3: R63.2
+5: R64.2
GND: P17.1 P17.3 P18.1
VCC_2V85: P17.40 R66.2
RXD: P17.35 P18.5 R68.2
Serial5_RX: R68.1 ; port RS232.RS232_RX
Serial5_TX: R67.1 ; port RS232.RS232_TX
TXD: P17.31 P18.4 R66.1 R67.2
NetDS8_1: DS8.1(A) P17.5 P17.7 R63.1 R64.1
NetDS8_2: DS8.2(K) R65.2
NetP17_27: P17.27 R65.1

Not connected (* = marked no-connect by the designer): P17 2 4 6 8 9 10 11 12 13 14 15 16 17 18 19 20 21 22 23 24 25 26 28 29 30 32 33 34 36 37 38 39; P18 2* 3* 6*

### Notes on the sheet
- (near P18) Serial Connector
- Black
- Brown
- Red
- Orange
- Yellow
- Green
- (near P18) TTL-232R-3V3
- Title
- Size:
- Date:
- Orcad A
- Number:
- Time:
- Revision:
- Sheet
- of
- ZLS Corporation
- 7801 North Lamar Blvd.
- Suite E-184
- Austin, Texas 78752  USA
- (512) 453-0288
- File:

### Library data of the parts
DS8 = CMP-0239-00001-1: LED 468NM BLUE CLEAR 0603 SMD; Manufacturer 1: Lite-On Inc; Manufacturer Part Number 1: LTST-C191TBKT; Category 1: Optoelectronics; Wavelength - Dominant: 467.5nm; Millicandela Rating: 30mcd; Voltage - Forward (Vf) (Typ): 3.4V; Current - Test: 20mA; Viewing Angle: 130°; Lens Style/Size: Rectangle with Flat Top, 1.1mm x 0.8mm; Supplier 1: Digi-Key; Supplier Part Number 1: 160-1647-1-ND; RoHS 1: RoHS Compliant; Description 1: LED 468NM BLUE CLEAR 0603 SMD; Stock 1: 267074; Pricing 1: 1=0.46, 10=0.342, 100=0.1813, 250=0.12824, 500=0.10944, 1000=0.0855, 2500=0.07524 (USD); Packaging: Cut Tape (CT); Color: Blue; Wavelength - Peak: 468nm; Lens Type: Clear; Package / Case: 0603 (1608 Metric); Size / Dimension: 1.60mm L x 0.80mm W; Height: 0.55mm; Mounting Type: Surface Mount; Luminous Flux @ Current - Test: -; ComponentLink1URL: http://optoelectronics.liteon.com/upload/download/DS22-2000-230/S_110_LTST-C191TBKT.pdf; ComponentLink1Description: http://optoelectronics.liteon.com/upload/download/DS22-2000-230/S_110_LTST-C191TBKT.pdf
P17 = Header 20X2: 1MM SINGLE ELEMENT INTERFACE; Manufacturer 1: Samtec Inc.; Manufacturer Part Number 1: FSI-120-03-G-D-M-AB; Category 1: Connectors, Interconnects; Connector Type: Stacking Compression; Number of Positions: 40; Pitch: 0.039" (1.00mm); Supplier 1: Digi-Key; Supplier Part Number 1: SAM9413-ND; RoHS 1: RoHS Compliant; Description 1: 1MM SINGLE ELEMENT INTERFACE; Stock 1: 144; Pricing 1: 1=8.38, 10=7.752, 25=7.3324, 50=6.9554, 100=6.4945, 250=5.65652, 500=5.447, 1000=5.2375, 2500=5.028 (USD); Packaging: Tube; Part Status: Active; Number of Rows: 2; Mounting Type: Surface Mount; Features: Board Guide, Mounting Flange; Contact Finish: Gold; Contact Finish Thickness: 10µin (0.25µm); Mated Stacking Heights: -; Height Above Board: 0.118" (3.00mm); ComponentLink1URL: http://suddendocs.samtec.com/prints/fsi-1xx-03-x-d-x-xx-xx-mkt.pdf; ComponentLink1Description: http://suddendocs.samtec.com/prints/fsi-1xx-03-x-d-x-xx-xx-mkt.pdf
P18 = Header 6H: CABLE USB SERIAL 3.3V 2MM HEADER; Manufacturer 1: FTDI, Future Technology Devices International Ltd; Manufacturer Part Number 1: TTL-232R-3V3-2MM; Category 1: Cable Assemblies; Usage: USB to TTL Serial 3.3V; Convert From (Adapter End): USB - A, Plug; Convert To (Adapter End): Rectangular Connector, Female Sockets, 8 pos (7 open), 2mm; Shielding: Unshielded; Supplier 1: Digi-Key; Supplier Part Number 1: 768-1095-ND; RoHS 1: RoHS Compliant; Description 1: CABLE USB SERIAL 3.3V 2MM HEADER; Stock 1: 274; Pricing 1: 1=20, 10=18, 50=16.875 (USD); Part Status: Active; Length: 5.90' (1.80m); ComponentLink1URL: http://www.ftdichip.com/Support/Documents/DataSheets/Cables/DS_TTL-232R_CABLES.pdf; ComponentLink1Description: http://www.ftdichip.com/Support/Documents/DataSheets/Cables/DS_TTL-232R_CABLES.pdf
R63 = CMP-1013-00017-1: Manufacturer: Vishay; Manufacturer Part Number: CRCW08050000Z0EA; Power Rating: 125mW; Voltage Rating: 150V; Tolerance: 1%; Temperature Coefficient: 100ppm/°C; Supplier 1: Digi-Key; Supplier Part Number 1: 541-0.0ADKR-ND; Stock 1: 415251; Pricing 1: 1=0.1, 10=0.026, 25=0.0184, 50=0.014, 100=0.0104, 250=0.0079, 500=0.0063, 1000=0.0047 (USD); Case/Package: 0805; Weight: 0.000194oz; Contact Plating: Tin,Lead; Case Code (Imperial): 0805; Case Code (Metric): 2012; Min Operating Temperature: -55°C; Max Operating Temperature: 155°C; Composition: Thick Film; Termination: SMD/SMT; Packaging: Tape and Reel; Package Quantity: 1; Number of Terminations: 2; Military Standard: Not; Max Power Dissipation: 125mW; Voltage Rating (DC): 150V; Length: 2mm; Height: 0.45mm; Width: 1.25mm; Depth: 1.25mm; Radiation Hardening: No; Lead Free: Lead Free; REACH SVHC: Unknown; ComponentLink1URL: https://datasheet.ciiva.com/16883/dcrcwe3-16883622.pdf; ComponentLink1Description: https://datasheet.ciiva.com/16883/dcrcwe3-16883622.pdf; ComponentLink2URL: https://datasheet.ciiva.com/26314/fld-crcw-e3-data-en-26314630.pdf; ComponentLink2Description: https://datasheet.ciiva.com/26314/fld-crcw-e3-data-en-26314630.pdf; ComponentLink3URL: https://datasheet.ciiva.com/5543/dcrcwe3-109170-5543096.pdf; ComponentLink3Description: https://datasheet.ciiva.com/5543/dcrcwe3-109170-5543096.pdf; ComponentLink4URL: https://datasheet.ciiva.com/11811/0900766b80d98b26-11811304.pdf; ComponentLink4Description: https://datasheet.ciiva.com/11811/0900766b80d98b26-11811304.pdf; ComponentLink5URL: https://datasheet.ciiva.com/16389/dcrcwe3-16389338.pdf; ComponentLink5Description: https://datasheet.ciiva.com/16389/dcrcwe3-16389338.pdf; ComponentLink6URL: https://datasheet.ciiva.com/16719/70201119-16719706.pdf; ComponentLink6Description: https://datasheet.ciiva.com/16719/70201119-16719706.pdf; ComponentLink7URL: https://datasheet.ciiva.com/2463/dcrcwe3-2463037.pdf; ComponentLink7Description: https://datasheet.ciiva.com/2463/dcrcwe3-2463037.pdf; ComponentLink8URL: https://datasheet.ciiva.com/7841/1697337-7841629.pdf; ComponentLink8Description: https://datasheet.ciiva.com/7841/1697337-7841629.pdf; ComponentLink9URL: https://datasheet.ciiva.com/2463/dcrcwe3-2463038.pdf; ComponentLink9Description: https://datasheet.ciiva.com/2463/dcrcwe3-2463038.pdf; ComponentLink10URL: https://datasheet.ciiva.com/2463/dcrcwe3-2463039.pdf; ComponentLink10Description: https://datasheet.ciiva.com/2463/dcrcwe3-2463039.pdf; ComponentLink11URL: https://datasheet.ciiva.com/7841/1720486-7841839.pdf; ComponentLink11Description: https://datasheet.ciiva.com/7841/1720486-7841839.pdf
R64 = CMP-1013-00017-1: RES SMD 0.0 OHM JUMPER 1/8W 0805; Manufacturer: Vishay; Manufacturer Part Number: CRCW08050000Z0EA; Resistance: 0; Power Rating: 125mW; Voltage Rating: 150V; Tolerance: 1%; Temperature Coefficient: 100ppm/°C; Supplier 1: Digi-Key; Supplier Part Number 1: 541-0.0ADKR-ND; Stock 1: 415251; Pricing 1: 1=0.1, 10=0.026, 25=0.0184, 50=0.014, 100=0.0104, 250=0.0079, 500=0.0063, 1000=0.0047 (USD); Case/Package: 0805; Weight: 0.000194oz; Contact Plating: Tin,Lead; Case Code (Imperial): 0805; Case Code (Metric): 2012; Min Operating Temperature: -55°C; Max Operating Temperature: 155°C; Composition: Thick Film; Termination: SMD/SMT; Packaging: Tape and Reel; Package Quantity: 1; Number of Terminations: 2; Military Standard: Not; Max Power Dissipation: 125mW; Voltage Rating (DC): 150V; Length: 2mm; Height: 0.45mm; Width: 1.25mm; Depth: 1.25mm; Radiation Hardening: No; Lead Free: Lead Free; REACH SVHC: Unknown; ComponentLink1URL: https://datasheet.ciiva.com/16883/dcrcwe3-16883622.pdf; ComponentLink1Description: https://datasheet.ciiva.com/16883/dcrcwe3-16883622.pdf; ComponentLink2URL: https://datasheet.ciiva.com/26314/fld-crcw-e3-data-en-26314630.pdf; ComponentLink2Description: https://datasheet.ciiva.com/26314/fld-crcw-e3-data-en-26314630.pdf; ComponentLink3URL: https://datasheet.ciiva.com/5543/dcrcwe3-109170-5543096.pdf; ComponentLink3Description: https://datasheet.ciiva.com/5543/dcrcwe3-109170-5543096.pdf; ComponentLink4URL: https://datasheet.ciiva.com/11811/0900766b80d98b26-11811304.pdf; ComponentLink4Description: https://datasheet.ciiva.com/11811/0900766b80d98b26-11811304.pdf; ComponentLink5URL: https://datasheet.ciiva.com/16389/dcrcwe3-16389338.pdf; ComponentLink5Description: https://datasheet.ciiva.com/16389/dcrcwe3-16389338.pdf; ComponentLink6URL: https://datasheet.ciiva.com/16719/70201119-16719706.pdf; ComponentLink6Description: https://datasheet.ciiva.com/16719/70201119-16719706.pdf; ComponentLink7URL: https://datasheet.ciiva.com/2463/dcrcwe3-2463037.pdf; ComponentLink7Description: https://datasheet.ciiva.com/2463/dcrcwe3-2463037.pdf; ComponentLink8URL: https://datasheet.ciiva.com/7841/1697337-7841629.pdf; ComponentLink8Description: https://datasheet.ciiva.com/7841/1697337-7841629.pdf; ComponentLink9URL: https://datasheet.ciiva.com/2463/dcrcwe3-2463038.pdf; ComponentLink9Description: https://datasheet.ciiva.com/2463/dcrcwe3-2463038.pdf; ComponentLink10URL: https://datasheet.ciiva.com/2463/dcrcwe3-2463039.pdf; ComponentLink10Description: https://datasheet.ciiva.com/2463/dcrcwe3-2463039.pdf; ComponentLink11URL: https://datasheet.ciiva.com/7841/1720486-7841839.pdf; ComponentLink11Description: https://datasheet.ciiva.com/7841/1720486-7841839.pdf
R65 = CMP-1013-00017-1: Manufacturer: Vishay Dale; Manufacturer Part Number: CRCW0805383RFKEA; Power (Watts): 0.125W, 1/8W; Temperature Coefficient: ±100ppm/°C; Supplier 1: Digi-Key; Supplier Part Number 1: 541-383CDKR-ND; RoHS: RoHS Compliant; Category: Resistors; Stock 1: 21887; Pricing 1: 1=0.1, 10=0.044, 100=0.0178, 1000=0.00802, 2500=0.00696 (USD); Packaging: Digi-Reel®; Part Status: Active; Tolerance: ±1%; Composition: Thick Film; Features: Automotive AEC-Q200; Operating Temperature: -55°C ~ 155°C; Package / Case: 0805 (2012 Metric); Supplier Device Package: 0805; Size / Dimension: 0.079" L x 0.049" W (2.00mm x 1.25mm); Height - Seated (Max): 0.020" (0.50mm); Failure Rate: -; ComponentLink1URL: http://www.vishay.com/docs/20035/dcrcwe3.pdf; ComponentLink1Description: http://www.vishay.com/docs/20035/dcrcwe3.pdf
R66 = CMP-1013-00017-1: RES SMD 1K OHM 1% 1/2W 0805; Manufacturer: Vishay Dale; Manufacturer Part Number: CRCW08051K00FKEAHP; Power (Watts): 0.5W, 1/2W; Temperature Coefficient: ±100ppm/°C; Supplier 1: Digi-Key; Supplier Part Number 1: 541-1.00KTDKR-ND; RoHS: RoHS Compliant; Category: Resistors; Stock 1: 64012; Pricing 1: 1=0.28, 10=0.233, 100=0.0911, 1000=0.03812, 2500=0.03494 (USD); Packaging: Digi-Reel®; Part Status: Active; Tolerance: ±1%; Composition: Thick Film; Features: Automotive AEC-Q200, Pulse Withstanding; Operating Temperature: -55°C ~ 155°C; Package / Case: 0805 (2012 Metric); Supplier Device Package: 0805; Size / Dimension: 0.079" L x 0.049" W (2.00mm x 1.25mm); Height - Seated (Max): 0.020" (0.50mm); Failure Rate: -; ComponentLink1URL: http://www.vishay.com/docs/20043/crcwhpe3.pdf; ComponentLink1Description: http://www.vishay.com/docs/20043/crcwhpe3.pdf
R67 R68 = CMP-1013-00393-1: Manufacturer: Vishay Dale; Manufacturer Part Number: CRCW0805100RFKEA; Power (Watts): 0.125W, 1/8W; Temperature Coefficient: ±100ppm/°C; Supplier 1: Digi-Key; Supplier Part Number 1: 541-100CDKR-ND; RoHS: RoHS Compliant; Category: Resistors; Stock 1: 281212; Pricing 1: 1=0.1, 10=0.044, 100=0.0178, 1000=0.00802, 2500=0.00696 (USD); Packaging: Digi-Reel®; Part Status: Active; Tolerance: ±1%; Composition: Thick Film; Features: Automotive AEC-Q200; Operating Temperature: -55°C ~ 155°C; Package / Case: 0805 (2012 Metric); Supplier Device Package: 0805; Size / Dimension: 0.079" L x 0.049" W (2.00mm x 1.25mm); Height - Seated (Max): 0.020" (0.50mm); Failure Rate: -; ComponentLink1URL: http://www.vishay.com/docs/20035/dcrcwe3.pdf; ComponentLink1Description: http://www.vishay.com/docs/20035/dcrcwe3.pdf